# EAGLE schematic colorTemp_Print2 (EAGLE 9.6.1)
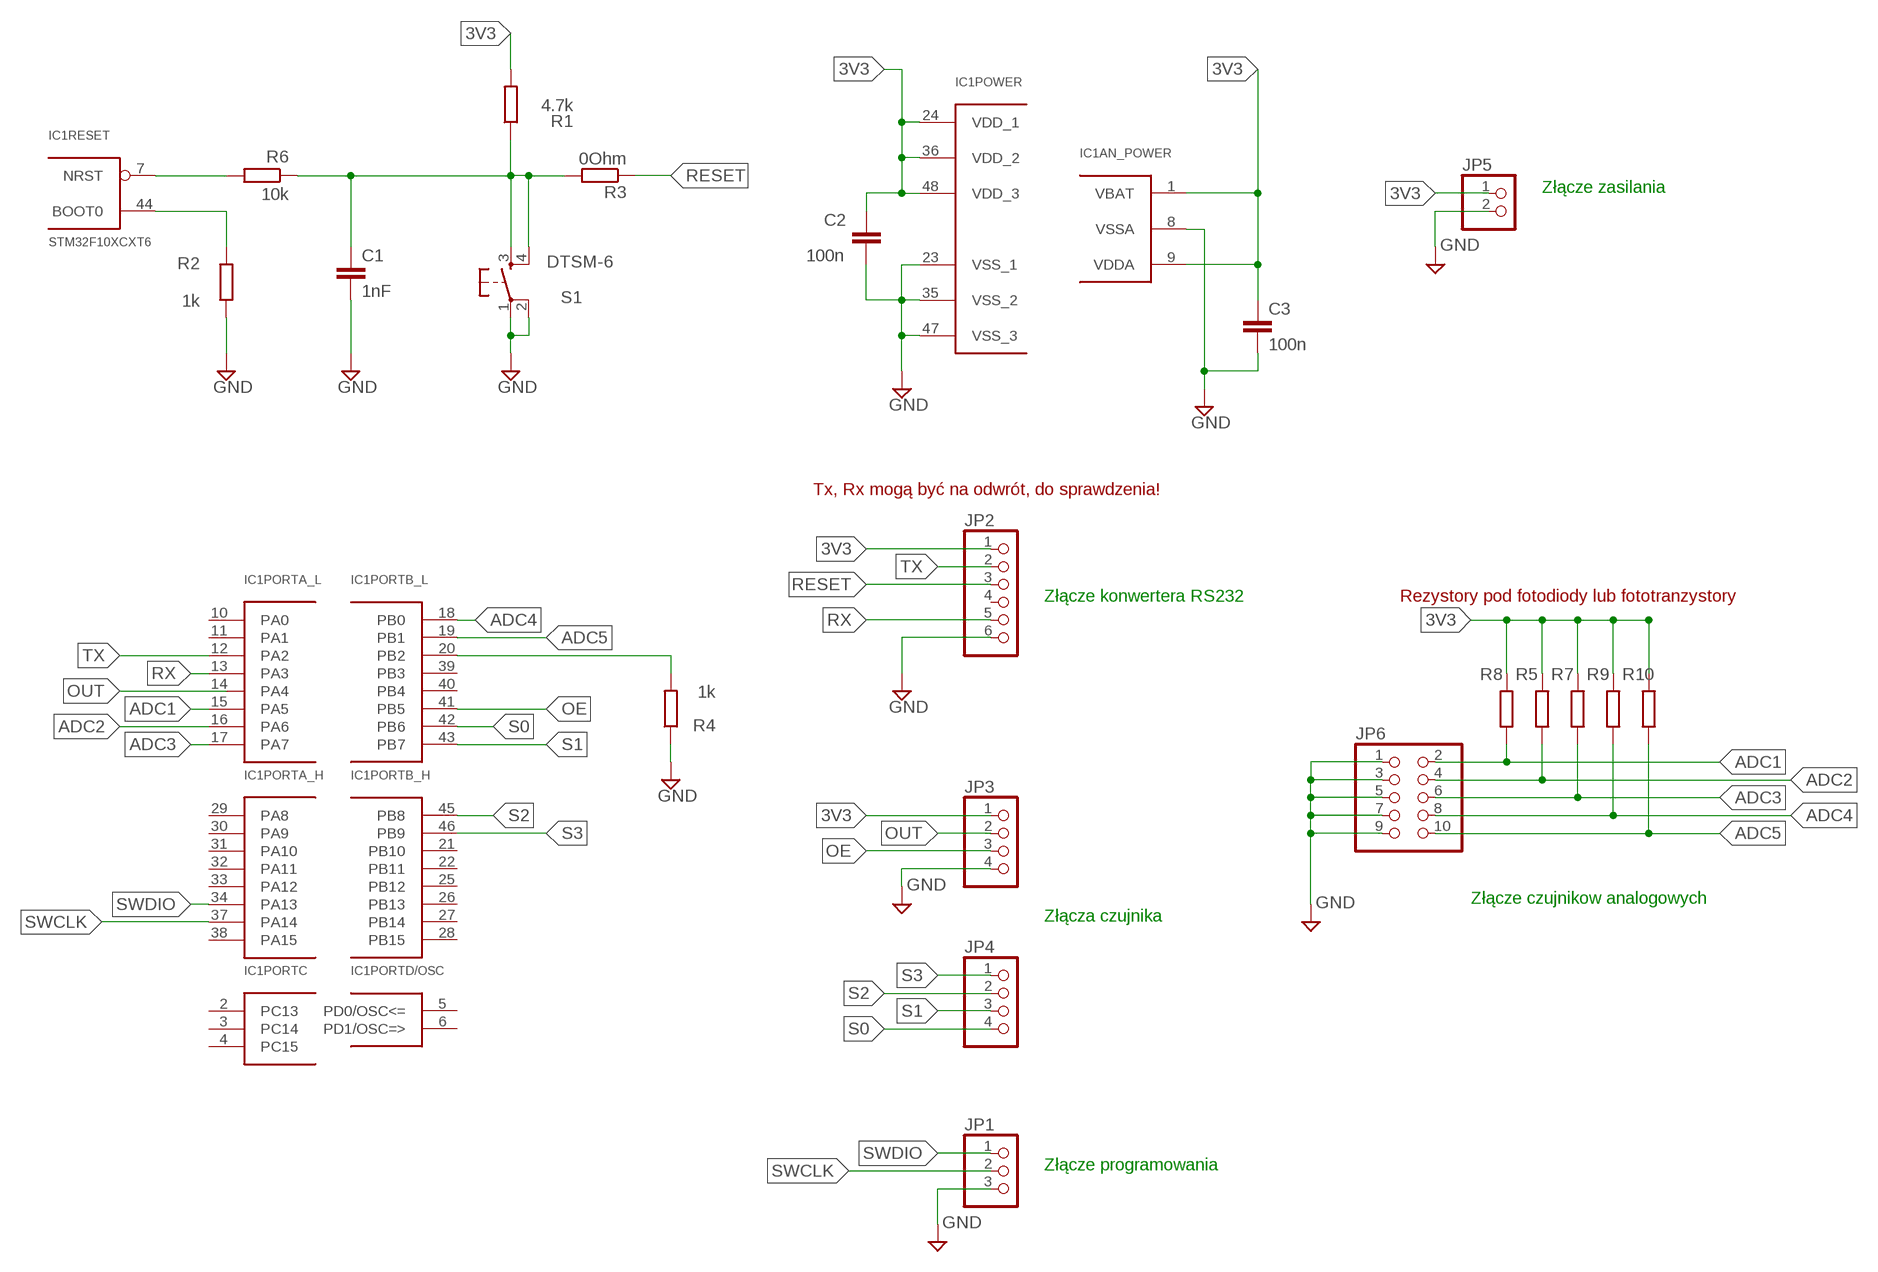
[diagram p0: schematic, sheet 1]

## Parts
C1  1nF  C-EUC0402  [C0402]
C2  100n  C-EUC0402  [C0402]
C3  100n  C-EUC0402  [C0402]
IC1  STM32F10XCXT6  [TQFP48]
JP1  PINHD-1X3  [1X03]
JP2  PINHD-1X6/90  [1X06/90]
JP3  PINHD-1X4  [1X04]
JP4  PINHD-1X4  [1X04]
JP5  PINHD-1X2  [1X02]
JP6  PINHD-2X5  [2X05]
R1  4.7k  R-EU_R0402  [R0402]
R2  1k  R-EU_R0402  [R0402]
R3  0Ohm  R-EU_R0402  [R0402]
R4  1k  R-EU_R0402  [R0402]
R5  R-EU_R0402  [R0402]
R6  10k  R-EU_R0402  [R0402]
R7  R-EU_R0402  [R0402]
R8  R-EU_R0402  [R0402]
R9  R-EU_R0402  [R0402]
R10  R-EU_R0402  [R0402]
S1  DTSM-6  [DTSM-6]

## Nets
3V3: C2.1 C3.1 IC1.1(AN_POWER:VBAT) IC1.9(AN_POWER:VDDA) IC1.24(POWER:VDD_1) IC1.36(POWER:VDD_2) IC1.48(POWER:VDD_3) JP2.1 JP3.1 JP5.1 R1.2 R5.1 R7.1 R8.1 R9.1 R10.1
ADC1: IC1.15(PORTA_L:PA5) JP6.2 R8.2
ADC2: IC1.16(PORTA_L:PA6) JP6.4 R5.2
ADC3: IC1.17(PORTA_L:PA7) JP6.6 R7.2
ADC4: IC1.18(PORTB_L:PB0) JP6.8 R9.2
ADC5: IC1.19(PORTB_L:PB1) JP6.10 R10.2
GND: C1.2 C2.2 C3.2 IC1.8(AN_POWER:VSSA) IC1.23(POWER:VSS_1) IC1.35(POWER:VSS_2) IC1.47(POWER:VSS_3) JP1.3 JP2.6 JP3.4 JP5.2 JP6.1 JP6.3 JP6.5 JP6.7 JP6.9 R2.1 R4.1 S1.1 S1.2
N$2: IC1.44(RESET:BOOT0) R2.2
N$9: IC1.20(PORTB_L:PB2) R4.2
N$18: IC1.7(RESET:NRST) R6.2
N$20: C1.1 R1.1 R3.2 R6.1 S1.3 S1.4
OE: IC1.41(PORTB_L:PB5) JP3.3
OUT: IC1.14(PORTA_L:PA4) JP3.2
RESET: JP2.3 R3.1
RX: IC1.13(PORTA_L:PA3) JP2.5
S0: IC1.42(PORTB_L:PB6) JP4.4
S1: IC1.43(PORTB_L:PB7) JP4.3
S2: IC1.45(PORTB_H:PB8) JP4.2
S3: IC1.46(PORTB_H:PB9) JP4.1
SWCLK: IC1.37(PORTA_H:PA14) JP1.2
SWDIO: IC1.34(PORTA_H:PA13) JP1.1
TX: IC1.12(PORTA_L:PA2) JP2.2
Unconnected: IC1.2(PORTC:PC13) IC1.3(PORTC:PC14) IC1.4(PORTC:PC15) IC1.5(PORTD/OSC:PD0/OSC<=) IC1.6(PORTD/OSC:PD1/OSC=>) IC1.10(PORTA_L:PA0) IC1.11(PORTA_L:PA1) IC1.21(PORTB_H:PB10) IC1.22(PORTB_H:PB11) IC1.25(PORTB_H:PB12) IC1.26(PORTB_H:PB13) IC1.27(PORTB_H:PB14) IC1.28(PORTB_H:PB15) IC1.29(PORTA_H:PA8) IC1.30(PORTA_H:PA9) IC1.31(PORTA_H:PA10) IC1.32(PORTA_H:PA11) IC1.33(PORTA_H:PA12) IC1.38(PORTA_H:PA15) IC1.39(PORTB_L:PB3) IC1.40(PORTB_L:PB4) JP2.4

## Notes on the sheet
- Złącze zasilania
- Tx, Rx mogą być na odwrót, do sprawdzenia!
- Złącze konwertera RS232 | Rezystory pod fotodiody lub fototranzystory
- Złącze czujnikow analogowych
- Złącza czujnika
- Złącze programowania

## Library data of the parts
C1-C3 = rcl:C-EU: CAPACITOR, European symbol; SPICEPREFIX: C
IC1 = stm32:STM32F10XCXT6: ST STM32F101/103 48pin LQFP
JP1 = pinhead:PINHD-1X3: PIN HEADER
JP2 = pinhead:PINHD-1X6: PIN HEADER
JP3 JP4 = pinhead:PINHD-1X4: PIN HEADER
JP5 = pinhead:PINHD-1X2: PIN HEADER
JP6 = pinhead:PINHD-2X5: PIN HEADER
R1-R10 = rcl:R-EU_: RESISTOR, European symbol; SPICEPREFIX: R
S1 = switch-tact:DTSM-6